# EAGLE design mainbrd (EAGLE 5.10)
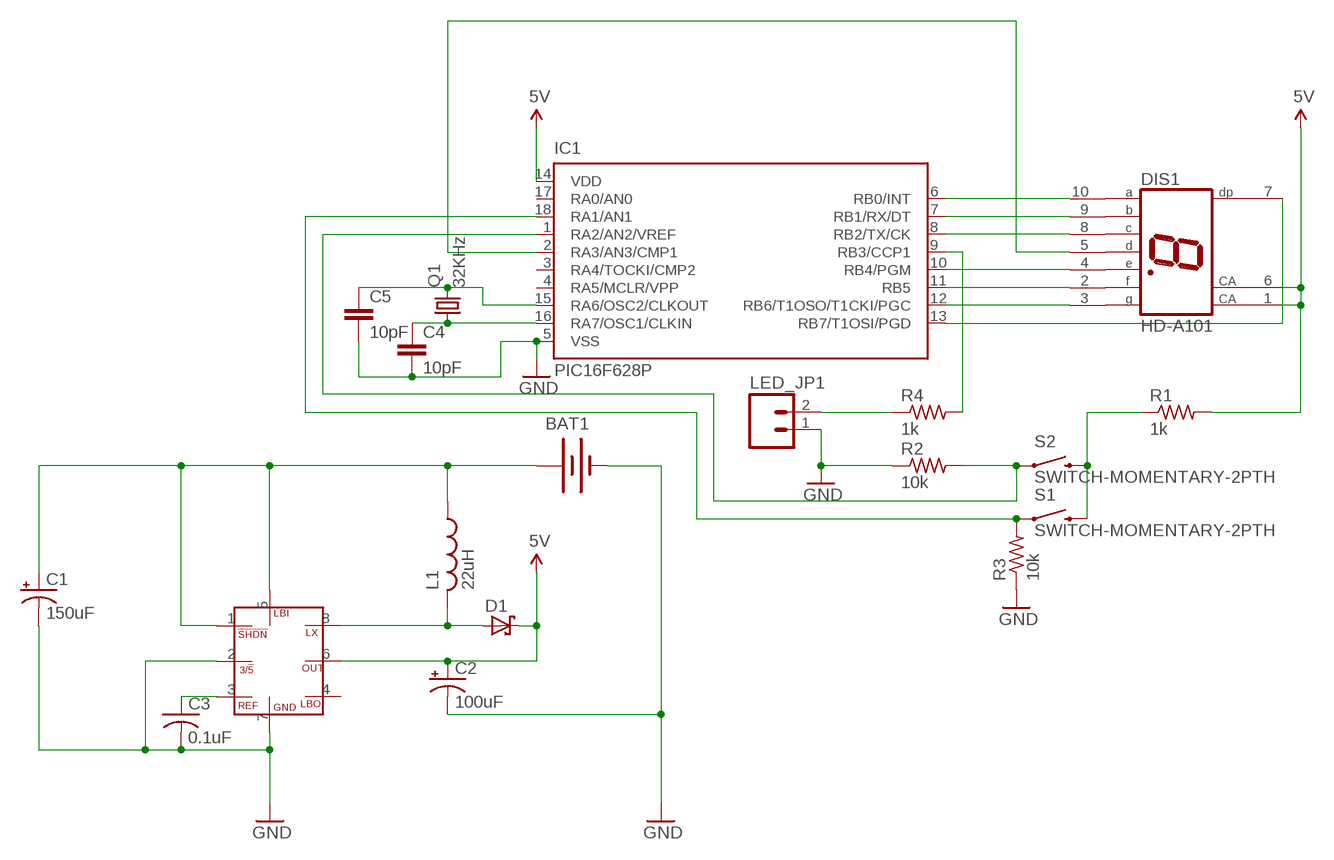
[diagram p0: schematic, sheet 1]

## Parts
BAT1  BATTERYAA  [BATTERY-AA]
C1  150uF  CPOL-USE2-5  [E2-5]
C2  100uF  CPOL-USE2-5  [E2-5]
C3  0.1uF  C-US050-030X075  [C050-030X075]
C4  10pF  C2.5/2  [C2.5-2]
C5  10pF  C2.5/2  [C2.5-2]
D1  SCHOTTKY-DIODESMA  [SMA-DO214AC]
DIL1  MAX756CSA  [SO-08]
DIS1  HD-A101  [HDSP-A]
IC1  PIC16F628P  [DIL18]
L1  22uH  L-US6000-XXX-RC  [6000-XXXX-RC]
LED_JP1  M02PTH  [1X02]
Q1  32KHz  CRYSTALTC26H  [TC26H]
R1  1k  R-US_0204/7  [0204/7@1]
R2  10k  R-US_0204/7  [0204/7@1]
R3  10k  R-US_0204/7  [0204/7@1]
R4  1k  R-US_0204/7  [0204/7@1]
S1  SWITCH-MOMENTARY-2PTH  [TACTILE-PTH]
S2  SWITCH-MOMENTARY-2PTH  [TACTILE-PTH]

## Nets
5V: C2.+ D1.K(C) DIL1.6(OUT.P$6) DIS1.1(CA) DIS1.6(CA) IC1.14(VDD) R1.2
GND: BAT1.GND@1(-) C1.- C2.- C3.2 C4.2 C5.2 DIL1.2(35.P$2) DIL1.7(GND.P$4) IC1.5(VSS) LED_JP1.1 R2.1 R3.1
N$1: C3.1 DIL1.3(REF.P$3)
N$2: BAT1.PWR@1(+) C1.+ DIL1.1(SHDN.P$1) DIL1.5(LBI.P$8) L1.1
N$3: D1.A DIL1.8(LX.P$7) L1.2
N$4: DIS1.4(E) IC1.10(RB4/PGM)
N$5: DIS1.2(F) IC1.11(RB5)
N$6: DIS1.3(G) IC1.12(RB6/T1OSO/T1CKI/PGC)
N$7: DIS1.5(D) IC1.2(RA3/AN3/CMP1)
N$8: DIS1.10(A) IC1.6(RB0/INT)
N$9: DIS1.9(B) IC1.7(RB1/RX/DT)
N$10: DIS1.8(C) IC1.8(RB2/TX/CK)
N$11: IC1.1(RA2/AN2/VREF) R2.2 S2.1
N$12: IC1.18(RA1/AN1) R3.2 S1.1
N$13: R1.1 S1.3 S2.3
N$14: LED_JP1.2 R4.1
N$15: IC1.9(RB3/CCP1) R4.2
N$16: C5.1 IC1.15(RA6/OSC2/CLKOUT) Q1.2
N$17: C4.1 IC1.16(RA7/OSC1/CLKIN) Q1.1
N$18: DIS1.7(DP) IC1.13(RB7/T1OSI/PGD)
Unconnected: DIL1.4(LBO.P$5) IC1.3(RA4/TOCKI/CMP2) IC1.4(RA5/MCLR/VPP) IC1.17(RA0/AN0)

## Library data of the parts
BAT1 = SparkFun:BATTERY: Battery Holders Various common sizes : AA, AAA, 20mm coin cell and 12mm coin cell.
C1 C2 = resistor:CPOL-US: POLARIZED CAPACITOR, American symbol
C3 = resistor:C-US: CAPACITOR, American symbol
C4 C5 = capacitor-wima:C: CAPACITOR naming: grid - package width
D1 = jorjs_parts:SCHOTTKY-DIODE: Schottky Diode
DIL1 = jorjs_parts:MAX756
DIS1 = display-hp:HD-A101: LED DISPLAY 1-character 7 segment, decimal point right
IC1 = microchip:PIC16F62*: FLASH-Based 8-Bit CMOS Microcontroller Source: http://ww1.microchip.com/downloads/en/DeviceDoc/40300C.pdf
L1 = rcl:L-US: INDUCTOR, American symbol
LED_JP1 = SparkFun:M02: Header 2 Standard 2-pin 0.1" header. Use with straight break away headers (SKU : PRT-00116), right angle break away headers (PRT-00553), swiss pins (PRT-00743), machine pins (PRT-00117), and female headers (PRT-00115). Molex polarized connector foot print use with SKU : PRT-08233 with associated crimp pins and housings.
Q1 = crystal:CRYSTAL: CRYSTAL
R1-R4 = rcl:R-US_: RESISTOR, American symbol
S1 S2 = SparkFun:SWITCH-MOMENTARY-2

## Board
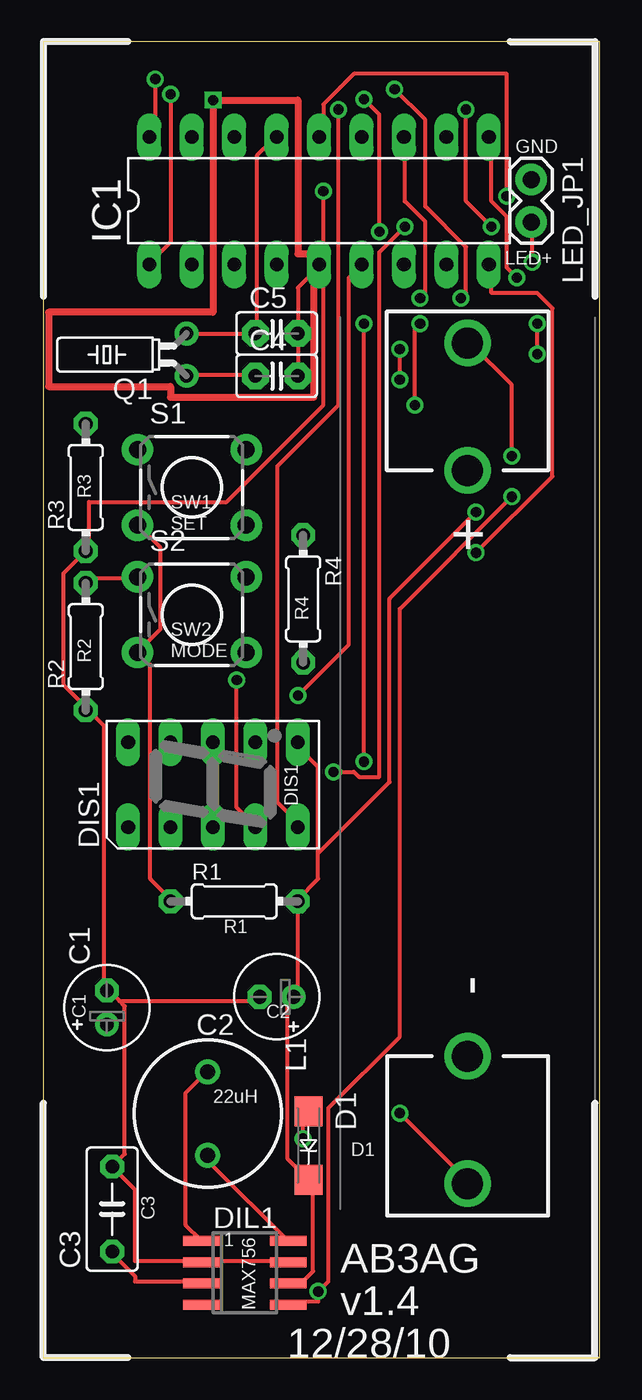
[diagram p1: board, top side]
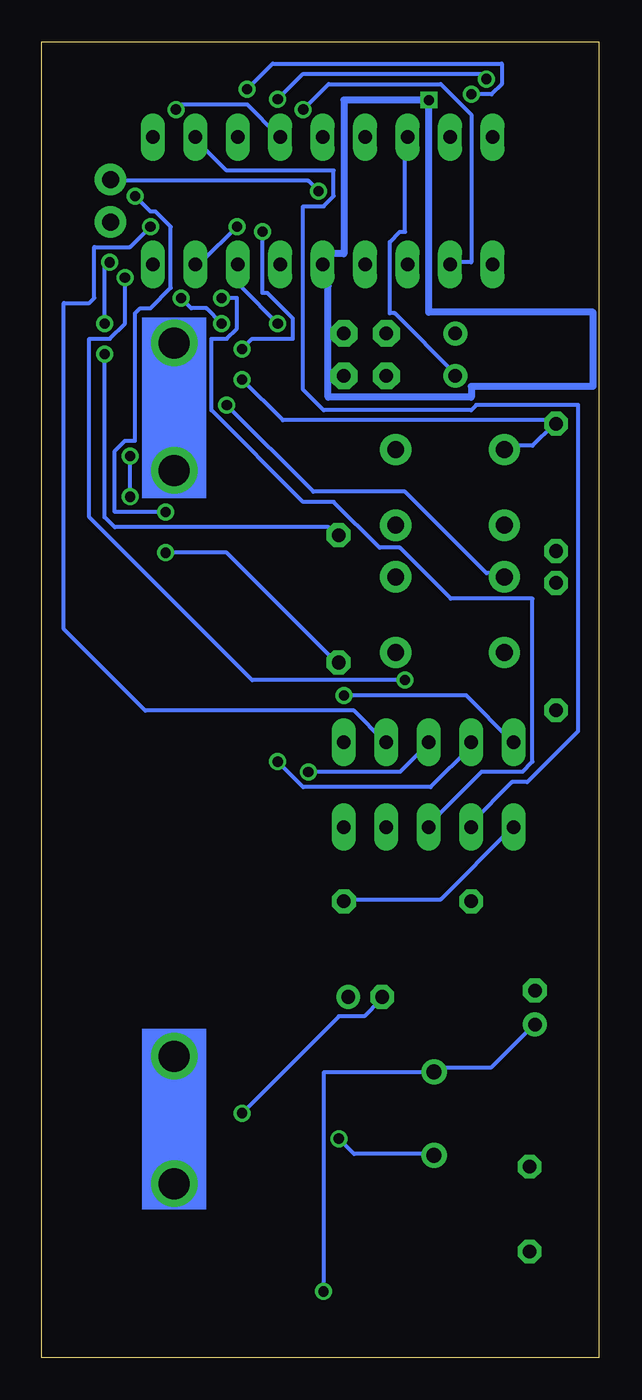
[diagram p2: board, bottom side, seen from below]

Size 33.33 x 78.73 mm. Coordinates in mm from the lower left corner, seen from the top.
Outline: 0,0 33.33,0 33.33,78.73 0,78.73 0,0
Copper layers (1*16): Top 0.035mm / dielectric 1.5mm / Bottom 0.035mm
Design rules "default *": minimum track width 10mil, minimum drill 24mil, track to track 8mil, track to pad 8mil, pad to pad 8mil, via to via 8mil, smd to smd 8mil, copper to edge 40mil, drill to drill 8mil, minimum pad ring 12mil, minimum via ring 8mil, stop-mask expansion 4mil, vias tented up to drill 0mil, thermal gap 10mil
tKeepout: area 0,73.7 to 5.1,78.7; area 0,63.5 to 2.5,73.7; area 27.9,73.7 to 33,78.7; area 30.5,63.5 to 33,73.7; area 30.5,5.1 to 33,15.2; area 27.9,0 to 33,5.1; area 0,0 to 5.1,5.1; area 0,5.1 to 2.5,15.2
bKeepout: area 0,73.7 to 5.1,78.7; area 0,63.5 to 2.5,73.7; area 27.9,73.7 to 33,78.7; area 30.5,63.5 to 33,73.7; area 30.5,5.1 to 33,15.2; area 27.9,0 to 33,5.1; area 0,0 to 5.1,5.1; area 0,5.1 to 2.5,15.2
tRestrict: area 0,73.7 to 5.1,78.7; area 27.9,73.7 to 33,78.7; area 30.5,63.5 to 33,73.7; area 0,63.5 to 2.5,73.7; area 0,5.1 to 2.5,15.2; area 0,0 to 5.1,5.1; area 27.9,0 to 33,5.1; area 30.5,5.1 to 33,15.2
bRestrict: area 0,73.7 to 5.1,78.7; area 0,63.5 to 2.5,73.7; area 27.9,73.7 to 33,78.7; area 30.5,63.5 to 33,73.7; area 30.5,5.1 to 33,15.2; area 27.9,0 to 33,5.1; area 0,0 to 5.1,5.1; area 0,5.1 to 2.5,15.2

### Footprints (pad centres in the part's own frame; a part is rotated, then mirrored left to right if it is on the bottom)
BATTERY-AA = drill 1.854 round: GND@1 25.146,0; GND@2 17.526,0; PWR@1 -25.146,0; PWR@2 -17.526,0
E2-5 = drill 0.813 pad 1.27 round: + -1.016,0 | drill 0.813 pad 1.27 octagon: - 1.016,0
C050-030X075 = drill 0.813 octagon: 1 -2.54,0; 2 2.54,0
C2.5-2 = drill 0.813 pad 1.6 octagon: 1 -1.27,0; 2 1.27,0
SMA-DO214AC = smd 1.8 x 1.7: A -2.05,0; K 2.05,0
SO-08 = smd 0.6 x 2.2: 1 -1.905,-2.6; 2 -0.635,-2.6; 3 0.635,-2.6; 4 1.905,-2.6; 5 1.905,2.6; 6 0.635,2.6; 7 -0.635,2.6; 8 -1.905,2.6
HDSP-A = drill 0.813 long: 1 -2.54,5.08; 2 -2.54,2.54; 3 -2.54,0; 4 -2.54,-2.54; 5 -2.54,-5.08; 6 2.54,-5.08; 7 2.54,-2.54; 8 2.54,0; 9 2.54,2.54; 10 2.54,5.08
DIL18 = drill 0.813 long: 1 -10.16,-3.81; 2 -7.62,-3.81; 3 -5.08,-3.81; 4 -2.54,-3.81; 5 0,-3.81; 6 2.54,-3.81; 7 5.08,-3.81; 8 7.62,-3.81; 9 10.16,-3.81; 10 10.16,3.81; 11 7.62,3.81; 12 5.08,3.81; 13 2.54,3.81; 14 0,3.81; 15 -2.54,3.81; 16 -5.08,3.81; 17 -7.62,3.81; 18 -10.16,3.81
6000-XXXX-RC = drill 0.9 pad 1.422 round: 1 -2.5,0; 2 2.5,0
1X02 = drill 1.016 pad 1.88 round: 1 0,0; 2 2.54,0
TC26H = drill 0.813 round: 1 -1.27,0; 2 1.27,0
0204/7@1 = drill 0.813 octagon: 1 -3.81,0; 2 3.81,0
TACTILE-PTH = drill 1.016 pad 1.88 round: 1 -3.251,2.261; 2 3.251,2.261; 3 -3.251,-2.261; 4 3.251,-2.261

### Placement (x,y rotation side)
BAT1  25.4,35.56 270 top
C1  3.81,20.95 90 top
C2  13.97,21.59 180 top
C3  4.13,8.89 90 top
C4  13.97,58.74 0 top
C5  13.97,61.28 0 top
D1  15.88,12.7 270 top
DIL1  12.06,5.08 270 top
DIS1  10.16,34.29 90 top
IC1  16.51,69.22 0 top
L1  9.84,14.61 270 top
LED_JP1  29.21,70.48 270 top
Q1  8.57,60.01 90 top
R1  11.43,27.3 0 top
R2  2.54,42.55 90 top
R3  2.54,52.07 90 top
R4  15.56,45.4 270 top
S1  8.89,52.07 0 top
S2  8.89,44.45 0 top

### Tracks (layer width: path | path; a pad name or v marks a point on that pad's centre or on a via)
5V  (via drill 0.61)
  Top 0.254: DIL1.6 14.94,4.57 15.54,4.57 16.15,5.18 16.15,10.36 D1.K 15.85,10.67 14.63,11.89 14.63,21.03 14.94,21.34 C2.+ 15.24,21.64 R1.2 15.24,27.43 16.46,28.65 16.46,30.18 | 16.46,30.18 16.46,35.36 15.24,36.58 DIS1.6 | v27.74,69.49 27.74,76.81 18.59,76.81 16.76,74.98 16.76,73.15 IC1.14 | v25.91,50.6 20.73,45.41 20.73,34.44 16.46,30.18
  Bottom 0.254: DIS1.1 5.18,31.7 9.45,27.43 15.24,27.43 R1.2 | v27.74,69.49 26.82,68.58 26.52,68.58 25.6,67.67 25.6,64.01 26.82,62.79 27.43,62.79 27.74,62.48 27.74,54.86 28.35,54.86 28.96,54.25 28.96,50.6 v25.91,50.6
GND  (via drill 0.61)
  Top 0.254: IC1.5 16.46,65.23 15.24,64.01 C5.2 C4.2 | v16.76,69.8 16.76,65.53 IC1.5 | DIL1.7 14.63,5.79 9.75,5.79 DIL1.2 9.45,5.79 5.49,5.79 5.49,10.06 4.27,11.28 C3.2 4.27,11.58 4.88,12.19 4.88,21.03 4.57,21.34 | 4.57,21.34 3.96,21.95 C1.- 3.66,22.25 3.66,37.8 2.74,38.71 R2.1 2.44,39.01 1.22,40.23 1.22,46.94 R3.1 2.74,48.46 2.74,51.21 10.97,51.21 16.76,57 16.76,65.23 IC1.5 | 4.57,21.34 12.8,21.34 C2.- | v21.34,14.63 25.3,10.67 BAT1.GND@1
  Bottom 0.254: v16.76,69.8 17.37,70.41 28.96,70.41 LED_JP1.1 | v21.34,14.63 15.54,20.42 14.02,20.42 13.11,21.34 C2.-
N$1
  Top 0.254: DIL1.3 9.45,4.57 5.49,4.57 5.49,4.88 4.27,6.1 C3.1
N$2  (via drill 0.61)
  Top 0.254: DIL1.1 9.45,7.01 8.53,7.92 8.53,15.85 9.75,17.07 L1.1 | DIL1.5 14.94,3.35 16.46,3.35 v16.46,3.96 17.07,4.57 17.07,14.94 21.34,19.2 21.34,44.81 v28.04,51.51 | v28.04,53.95 28.04,58.22 25.6,60.66 BAT1.PWR@1
  Bottom 0.254: v16.46,3.96 16.46,17.07 10.06,17.07 L1.1 9.75,17.37 6.4,17.37 3.96,19.81 C1.+ | v28.04,51.51 v28.04,53.95
N$3  (via drill 0.61)
  Top 0.254: v15.54,13.11 15.54,14.33 15.85,14.63 D1.A | DIL1.8 14.63,7.01 10.06,11.58 10.06,11.89 L1.2
  Bottom 0.254: v15.54,13.11 14.63,12.19 10.06,12.19 L1.2
N$4  (via drill 0.61)
  Top 0.254: v11.58,40.54 11.58,32.92 12.5,32 DIS1.4 | v28.35,64.62 27.74,65.23 27.74,68.28 26.82,69.19 26.82,72.85 IC1.10
  Bottom 0.254: v11.58,40.54 20.73,40.54 30.48,50.29 30.48,60.96 29.26,60.96 28.35,61.87 v28.35,64.62
N$5
  Bottom 0.254: DIS1.2 7.62,32 5.18,34.44 4.27,34.44 1.22,37.49 1.22,57 7.32,57 7.62,56.69 16.46,56.69 17.68,57.91 17.68,68.89 16.46,68.89 15.85,69.49 15.85,71.02 22.25,71.02 24.08,72.85 IC1.11
N$6  (via drill 0.61)
  Top 0.254: v22.55,63.4 22.86,63.7 22.86,67.97 21.64,69.19 21.64,72.85 IC1.12
  Bottom 0.254: v22.55,63.4 21.64,63.4 21.64,61.57 22.25,60.96 23.16,60.96 23.16,56.69 17.68,51.21 15.85,51.21 13.11,48.46 11.89,48.46 8.84,45.41 3.96,45.41 3.96,35.66 4.57,35.05 7.01,35.05 10.06,32 DIS1.3
N$7  (via drill 0.61)
  Top 0.254: v17.68,74.68 17.68,57 14.02,53.34 14.02,33.22 15.24,32 DIS1.5
  Bottom 0.254: v17.68,74.68 16.15,76.2 9.45,76.2 7.62,74.37 7.62,65.53 8.84,65.53 IC1.2
N$8  (via drill 0.61)
  Top 0.254: v15.24,39.62 18.29,42.67 18.29,64.62 18.9,65.23 IC1.6
  Bottom 0.254: v15.24,39.62 7.92,39.62 5.18,36.88 DIS1.10
N$9  (via drill 0.61)
  Top 0.254: v19.2,35.66 v19.2,61.87
  Bottom 0.254: v19.2,35.66 17.68,34.14 10.06,34.14 7.62,36.58 DIS1.9 | v19.2,61.87 21.34,64.01 21.34,65.23 IC1.7
N$10  (via drill 0.61)
  Top 0.254: v17.37,35.05 18.59,35.05 18.9,34.75 20.12,34.75 20.12,66.14 v21.64,67.67
  Bottom 0.254: v17.37,35.05 11.89,35.05 10.36,36.58 DIS1.8 | v21.64,67.67 23.77,65.53 24.08,65.53 IC1.8
N$11  (via drill 0.61)
  Top 0.254: R2.2 2.74,46.63 5.49,46.63 S2.1 | v7.62,75.59 7.62,66.75 6.4,65.53 IC1.1 | v21.03,75.89 22.86,74.07 22.86,68.89 25.3,66.45 25.3,63.7 v24.99,63.4 | v22.55,61.87 22.25,61.57 v22.25,57
  Bottom 0.254: v7.62,75.59 6.4,75.59 5.79,76.2 5.79,77.42 19.51,77.42 v21.03,75.89 | v24.99,63.4 24.38,62.79 23.47,62.79 v22.55,61.87 | v22.25,57 17.07,51.82 11.58,51.82 6.71,46.94 5.79,46.94 S2.1
N$12  (via drill 0.61)
  Top 0.254: v6.71,76.5 6.71,73.46 6.4,73.15 IC1.18 | v19.2,75.29 20.12,74.37 v20.12,67.36 | v21.34,58.52 v21.34,60.35
  Bottom 0.254: S1.1 5.49,54.56 3.96,54.56 2.74,55.78 R3.2 2.74,56.08 18.9,56.08 v21.34,58.52 | v6.71,76.5 7.01,76.81 17.68,76.81 v19.2,75.29 | v20.12,67.36 20.12,63.7 19.81,63.7 18.29,62.18 18.29,60.96 20.73,60.96 v21.34,60.35
N$13
  Top 0.254: R1.1 7.62,27.43 6.4,28.65 6.4,41.45 5.79,42.06 S2.3 5.79,42.37 7.01,43.59 7.01,48.46 5.79,49.68 S1.3
N$14  (via drill 0.61)
  Top 0.254: v29.57,60.05 v29.57,61.87 | v29.26,65.53 29.26,67.67 LED_JP1.2
  Bottom 0.254: v29.57,60.05 29.57,50.29 28.96,49.68 16.15,49.68 15.85,49.38 R4.1 | v29.57,61.87 29.57,65.53 v29.26,65.53
N$15  (via drill 0.61)
  Top 0.254: v25.91,48.16 30.48,52.73 30.48,62.79 29.57,63.7 26.82,63.7 26.82,65.23 IC1.9
  Bottom 0.254: v25.91,48.16 22.25,48.16 15.85,41.76 R4.2
N$16
  Top 0.254: Q1.2 8.84,61.27 12.5,61.27 C5.1 12.8,61.57 12.8,71.93 13.72,72.85 IC1.15
N$17
  Top 0.254: Q1.1 8.84,58.83 12.5,58.83 C4.1
  Bottom 0.254: IC1.16 11.58,72.85 11.58,67.36 11.89,67.36 12.5,66.75 12.5,62.48 12.19,62.48 8.53,58.83 Q1.1
N$18  (via drill 0.61)
  Top 0.254: v26.82,67.67 25.3,69.19 v25.3,74.68
  Bottom 0.254: v26.82,67.67 28.04,66.45 30.18,66.45 30.18,63.4 30.48,63.09 32,63.09 32,43.59 27.13,38.71 14.63,38.71 12.8,36.88 DIS1.7 | v25.3,74.68 24.99,74.98 21.03,74.98 19.2,73.15 IC1.13
N$21  (via drill 0.6)
  Top 0.406: 16.19,66.04 15.24,66.04 15.24,75.25 v10.16,75.25 10.16,62.55 0.32,62.55 0.32,58.1 7.62,58.1 7.62,57.47 16.19,57.47 16.19,64.14
  Bottom 0.406: 16.19,66.04 15.24,66.04 15.24,75.25 v10.16,75.25 10.16,62.55 0.32,62.55 0.32,58.1 7.62,58.1 7.62,57.47 16.19,57.47 16.19,64.14
(copper drawn outside any net)
  shapes: Bottom area x2

### Text on the board
tPlace: GND | LED+ | R3 | SW1 | SET | R4 | SW2 | R2 | MODE | DIS1 | R1 | C1 | C2 | 22uH | D1 | C3 | 1 | AB3AG | MAX756 | v1.4 | 12/28/10